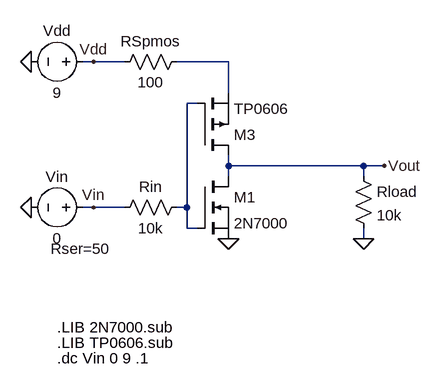
[diagram p0: schematic PreLab3.asc]
PreLab3.asc, the LTspice schematic file:
Version 4
SHEET 1 880 680
WIRE -16 -256 -32 -256
WIRE 32 -256 -16 -256
WIRE 192 -256 112 -256
WIRE 192 -208 192 -256
WIRE 144 -192 128 -192
WIRE 192 -96 192 -112
WIRE 400 -96 192 -96
WIRE 432 -96 400 -96
WIRE 192 -80 192 -96
WIRE 400 -80 400 -96
WIRE -16 -32 -32 -32
WIRE 32 -32 -16 -32
WIRE 128 -32 128 -192
WIRE 128 -32 112 -32
WIRE 128 0 128 -32
WIRE 144 0 128 0
WIRE 400 16 400 0
FLAG -112 -32 0
FLAG -112 -256 0
FLAG -16 -256 Vdd
FLAG -16 -32 Vin
FLAG 432 -96 Vout
FLAG 400 16 0
FLAG 192 16 0
SYMBOL voltage -16 -256 R90
WINDOW 0 -32 56 VBottom 2
WINDOW 3 32 56 VTop 2
WINDOW 123 0 0 Left 0
WINDOW 39 0 0 Left 0
SYMATTR InstName Vdd
SYMATTR Value 9
SYMBOL voltage -16 -32 R90
WINDOW 0 -32 56 VBottom 2
WINDOW 3 32 56 VTop 2
WINDOW 123 0 0 Left 0
WINDOW 39 79 20 VBottom 2
SYMATTR InstName Vin
SYMATTR Value 0
SYMATTR SpiceLine Rser=50
SYMBOL nmos 144 -80 R0
SYMATTR InstName M1
SYMATTR Value 2N7000
SYMBOL pmos 144 -112 M180
SYMATTR InstName M3
SYMATTR Value TP0606
SYMBOL res 128 -48 R90
WINDOW 0 0 56 VBottom 2
WINDOW 3 32 56 VTop 2
SYMATTR InstName Rin
SYMATTR Value 10k
SYMBOL res 128 -272 R90
WINDOW 0 0 56 VBottom 2
WINDOW 3 32 56 VTop 2
SYMATTR InstName RSpmos
SYMATTR Value 100
SYMBOL res 384 -96 R0
SYMATTR InstName Rload
SYMATTR Value 10k
TEXT -72 200 Left 2 !.dc Vin 0 9 .1
TEXT -72 176 Left 2 !.LIB TP0606.sub
TEXT -72 152 Left 2 !.LIB 2N7000.sub

The netlist it stands for:
* PreLab3.asc
Vdd Vdd 0 9
Vin Vin 0 0 Rser=50
M1 Vout N002 0 0 2N7000
M3 Vout N002 N001 N001 TP0606
Rin N002 Vin 10k
RSpmos N001 Vdd 100
Rload Vout 0 10k
.model NMOS NMOS
.model PMOS PMOS
.lib standard.mos
.dc Vin 0 9 .1
.LIB TP0606.sub
.LIB 2N7000.sub
.backanno
.end